# EAGLE design obd (EAGLE 5.11)
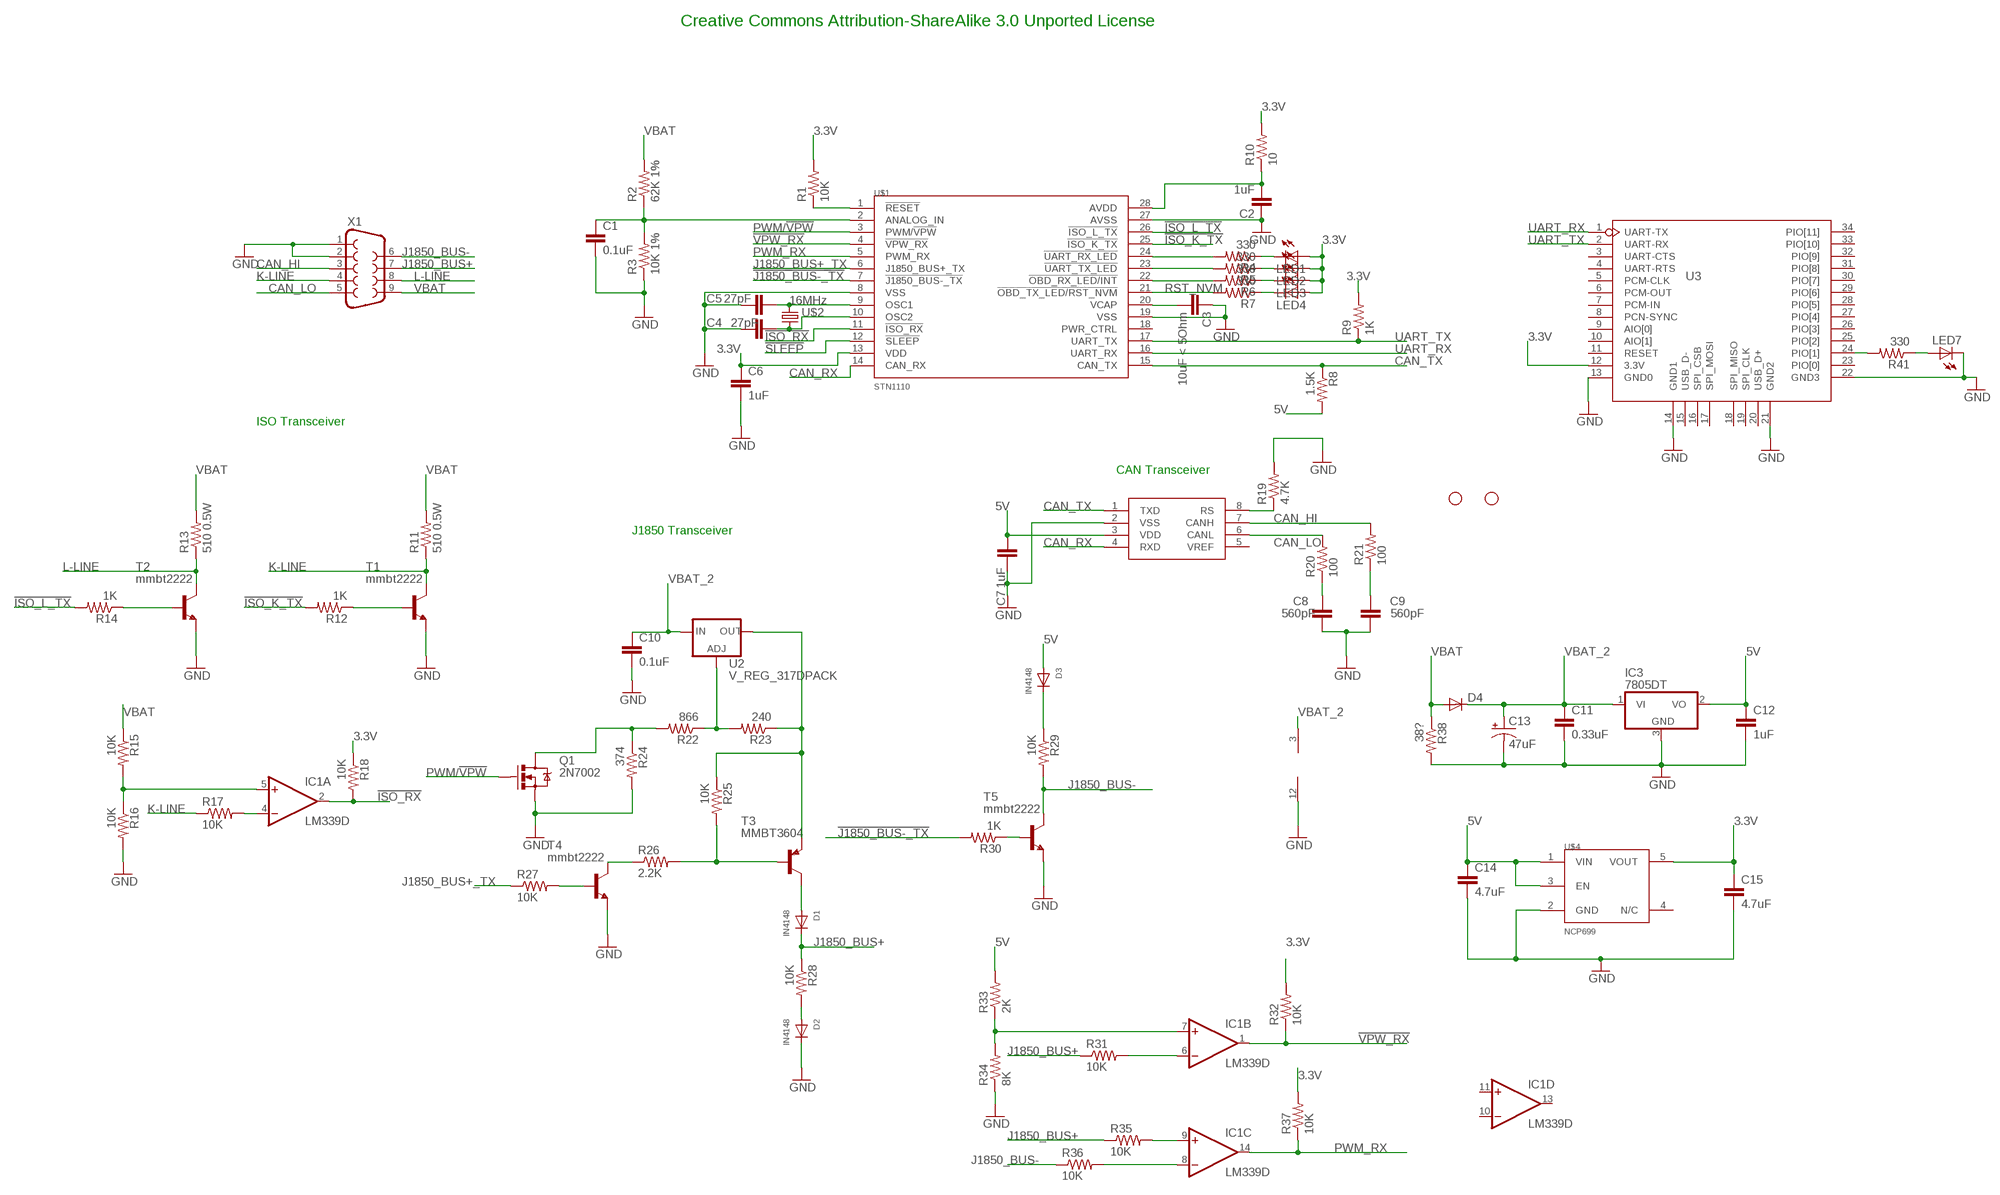
[diagram p0: schematic, sheet 1]

## Parts
C1  0.1uF  CAP0805  [0805]
C2  1uF  CAP0805  [0805]
C3  10uF < 5Ohm  CAP0805  [0805]
C4  27pF  CAP0805  [0805]
C5  27pF  CAP0805  [0805]
C6  1uF  CAP0805  [0805]
C7  1uF  CAP0805  [0805]
C8  560pF  CAP0805  [0805]
C9  560pF  CAP0805  [0805]
C10  0.1uF  CAP0805  [0805]
C11  0.33uF  CAP0805  [0805]
C12  1uF  CAP0805  [0805]
C13  47uF  CAP_POL1206  [EIA3216]
C14  4.7uF  CAP0805  [0805]
C15  4.7uF  CAP0805  [0805]
D1  IN4148  DIODESOD-123  [SOD-123]
D2  IN4148  DIODESOD-123  [SOD-123]
D3  IN4148  DIODESOD-123  [SOD-123]
D4  DIODESOD  [SOD-323]
IC1  LM339D  [SO14]
IC3  7805DT  [TO252]
JP2  STAND-OFF  [STAND-OFF]
JP3  STAND-OFF  [STAND-OFF]
LED1  LEDCHIPLED_0805  [CHIPLED_0805]
LED2  LEDCHIPLED_0805  [CHIPLED_0805]
LED3  LEDCHIPLED_0805  [CHIPLED_0805]
LED4  LEDCHIPLED_0805  [CHIPLED_0805]
LED7  LEDCHIPLED_0805  [CHIPLED_0805]
Q1  2N7002  MOSFET-NCHANNELSMD  [SOT23-3]
R1  10K  RESISTOR0805-RES  [0805]
R2  62K 1%  RESISTOR0805-RES  [0805]
R3  10K 1%  RESISTOR0805-RES  [0805]
R4  330  RESISTOR0805-RES  [0805]
R5  330  RESISTOR0805-RES  [0805]
R6  330  RESISTOR0805-RES  [0805]
R7  330  RESISTOR0805-RES  [0805]
R8  1.5K  RESISTOR0805-RES  [0805]
R9  1K  RESISTOR0805-RES  [0805]
R10  10  RESISTOR0805-RES  [0805]
R11  510 0.5W  RESISTOR1206  [1206]
R12  1K  RESISTOR0805-RES  [0805]
R13  510 0.5W  RESISTOR1206  [1206]
R14  1K  RESISTOR0805-RES  [0805]
R15  10K  RESISTOR0805-RES  [0805]
R16  10K  RESISTOR0805-RES  [0805]
R17  10K  RESISTOR0805-RES  [0805]
R18  10K  RESISTOR0805-RES  [0805]
R19  4.7K  RESISTOR0805-RES  [0805]
R20  100  RESISTOR0805-RES  [0805]
R21  100  RESISTOR0805-RES  [0805]
R22  866  RESISTOR0805-RES  [0805]
R23  240  RESISTOR0805-RES  [0805]
R24  374  RESISTOR0805-RES  [0805]
R25  10K  RESISTOR0805-RES  [0805]
R26  2.2K  RESISTOR0805-RES  [0805]
R27  10K  RESISTOR0805-RES  [0805]
R28  10K  RESISTOR0805-RES  [0805]
R29  10K  RESISTOR0805-RES  [0805]
R30  1K  RESISTOR0805-RES  [0805]
R31  10K  RESISTOR0805-RES  [0805]
R32  10K  RESISTOR0805-RES  [0805]
R33  2K  RESISTOR0805-RES  [0805]
R34  8K  RESISTOR0805-RES  [0805]
R35  10K  RESISTOR0805-RES  [0805]
R36  10K  RESISTOR0805-RES  [0805]
R37  10K  RESISTOR0805-RES  [0805]
R38  38?  RESISTOR0805-RES  [0805]
R41  330  RESISTOR0805-RES  [0805]
T1  mmbt2222  MMBT3904LT1-NPN-SOT23-BEC  [SOT23-BEC]
T2  mmbt2222  MMBT3904LT1-NPN-SOT23-BEC  [SOT23-BEC]
T3  MMBT3604  MMBT3640LT1-PNP-SOT23-BEC  [SOT23-BEC]
T4  mmbt2222  MMBT3904LT1-NPN-SOT23-BEC  [SOT23-BEC]
T5  mmbt2222  MMBT3904LT1-NPN-SOT23-BEC  [SOT23-BEC]
U1  MCP2551  [SO08]
U2  V_REG_317DPACK  [TO252]
U3  BLUETOOTH-SERIAL-SMD  [34P-1.524-27X13-W/-ANT]
U$1  STN1110  [SO-28W]
U$2  16MHz  CRYSTAL-2.5X3.5  [CRYSTAL-2.5X3.5]
U$4  NCP699  [SOT23-5]
X1  DB9MALE  [DB9_M]

## Nets
3.3V: C6.1 C15.1 LED1.A LED2.A LED3.A LED4.A R1.2 R9.2 R10.2 R18.1 R32.2 R37.2 U3.12(3.3V) U$1.13(VDD) U$4.5(VOUT)
5V: C7.2 C12.1 C14.1 D3.A IC3.2(VO) R8.2 R33.2 U1.3(VDD) U$4.1(VIN) U$4.3(EN)
!ISO_K_TX: R12.2 U$1.25(!ISO_K_TX)
!ISO_L_TX: R14.2 U$1.26(!ISO_L_TX)
!ISO_RX: IC1.2(A:OUT) R18.2 U$1.11(!ISO_RX)
!J1850_BUS-_TX: R30.2 U$1.7(!J1850_BUS-_TX)
!SLEEP: U$1.12(!SLEEP)
!VPW_RX: IC1.1(B:OUT) R32.1 U$1.4(!VPW_RX)
CAN_HI: R21.2 U1.7(CANH) X1.3
CAN_LO: R20.2 U1.6(CANL) X1.5
CAN_RX: U1.4(RXD) U$1.14(CAN_RX)
CAN_TX: R8.1 U1.1(TXD) U$1.15(CAN_TX)
GND: C1.2 C2.1 C3.1 C4.1 C5.1 C6.2 C7.1 C8.1 C9.1 C10.2 C11.2 C12.2 C13.C(-) C14.2 C15.2 D2.C IC1.12(P:GND) IC3.3(GND) LED7.C Q1.2(S) R3.1 R16.2 R19.2 R24.2 R34.1 R38.2 T1.E T2.E T4.E T5.E U1.2(VSS) U3.13(GND0) U3.14(GND1) U3.21(GND2) U3.22(GND3) U$1.8(VSS) U$1.19(VSS) U$1.27(AVSS) U$4.2(GND) X1.1 X1.2
J1850_BUS+: D1.C R28.1 R31.1 R35.1 X1.7
J1850_BUS+_TX: R27.1 U$1.6(J1850_BUS+_TX)
J1850_BUS-: R29.2 R36.1 T5.C X1.6
K-LINE: R11.1 R17.1 T1.C X1.4
L-LINE: R13.1 T2.C X1.8
N$1: R4.2 U$1.24(!UART_RX_LED)
N$2: R5.2 U$1.23(!UART_TX_LED)
N$3: R6.2 U$1.22(!OBD_RX_LED/INT)
N$4: R1.1 U$1.1(!RESET)
N$5: LED4.C R7.1
N$6: LED3.C R6.1
N$7: LED2.C R5.1
N$8: LED1.C R4.1
N$9: C1.1 R2.1 R3.2 U$1.2(ANALOG_IN)
N$10: C2.2 R10.1 U$1.28(AVDD)
N$11: C4.2 U$1.10(OSC2) U$2.P$1
N$12: C5.2 U$1.9(OSC1) U$2.P$3
N$13: IC1.4(A:-IN) R17.2
N$14: C3.2 U$1.20(VCAP)
N$15: R22.1 R23.2 U2.1(ADJ)
N$16: R14.1 T2.B
N$17: IC1.5(A:+IN) R15.2 R16.1
N$18: R23.1 R25.1 T3.E U2.4(OUT)
N$19: R12.1 T1.B
N$20: R25.2 R26.2 T3.B
N$21: R26.1 T4.C
N$22: Q1.3(D) R22.2 R24.1
N$23: R27.2 T4.B
N$24: R19.1 U1.8(RS)
N$25: D1.A T3.C
N$26: D3.C R29.1
N$27: C8.2 R20.1
N$28: C9.2 R21.1
N$29: D2.A R28.2
N$30: IC1.9(C:+IN) R35.2
N$31: IC1.8(C:-IN) R36.2
N$33: R30.1 T5.B
N$35: IC1.7(B:+IN) R33.1 R34.2
N$36: IC1.6(B:-IN) R31.2
N$39: R41.2 U3.24(PIO[1])
N$40: LED7.A R41.1
PWM/!VPW: Q1.1(G) U$1.3(PWM/!VPW)
PWM_RX: IC1.14(C:OUT) R37.1 U$1.5(PWM_RX)
RST_NVM: R7.2 U$1.21(!OBD_TX_LED/RST_NVM)
UART_RX: U3.1(UART-TX) U$1.16(UART_RX)
UART_TX: R9.1 U3.2(UART-RX) U$1.17(UART_TX)
VBAT: D4.2(A) R2.2 R11.2 R13.2 R15.1 R38.1 X1.9
VBAT_2: C10.1 C11.1 C13.A(+) D4.1(C) IC1.3(P:V+) IC3.1(VI) U2.3(IN)
Unconnected: IC1.10(D:-IN) IC1.11(D:+IN) IC1.13(D:OUT) U1.5(VREF) U3.3(UART-CTS) U3.4(UART-RTS) U3.5(PCM-CLK) U3.6(PCM-OUT) U3.7(PCM-IN) U3.8(PCN-SYNC) U3.9(AIO[0]) U3.10(AIO[1]) U3.11(RESET) U3.15(USB_D-) U3.16(SPI_CSB) U3.17(SPI_MOSI) U3.18(SPI_MISO) U3.19(SPI_CLK) U3.20(USB_D+) U3.23(PIO[0]) U3.25(PIO[2]) U3.26(PIO[3]) U3.27(PIO[4]) U3.28(PIO[5]) U3.29(PIO[6]) U3.30(PIO[7]) U3.31(PIO[8]) U3.32(PIO[9]) U3.33(PIO[10]) U3.34(PIO[11]) U$1.18(PWR_CTRL) U$4.4(N/C)

## Notes on the sheet
- Creative Commons Attribution-ShareAlike 3.0 Unported License
- ISO Transceiver
- CAN Transceiver
- J1850 Transceiver

## Library data of the parts
C1-C12 C14 C15 = SparkFun:CAP: Capacitor Standard 0603 ceramic capacitor, and 0.1" leaded capacitor.
C13 = SparkFun:CAP_POL: Capacitor Polarized These are standard SMD and PTH capacitors. Normally 10uF, 47uF, and 100uF in electrolytic and tantalum varieties. Always verify the external diameter of the through hole cap, it varies with capacity, voltage, and manufacturer. The EIA devices should be standard.
D1-D3 = adafruit:DIODE: Diode
D4 = SparkFun:DIODE: Diode
IC1 = linear:LM339: Low Power Low Offset Voltage Quad Comparators with open collector; LM139/LM239/LM339/LM2901/LM3302
IC3 = adafruit:78*: Positive VOLTAGE REGULATOR Added bigger pads to the TO-92 package
JP2 JP3 = SparkFun:STAND-OFF: Stand Off This is the mechanical footprint for a #4 phillips button head screw. Use the keepout ring to avoid running the screw head into surrounding components. SKU : PRT-00447
LED1-LED4 LED7 = adafruit:LED: LED OSRAM: - CHIPLED LG R971, LG N971, LY N971, LG Q971, LY Q971, LO R971, LY R971 LH N974, LH R974 LS Q976, LO Q976, LY Q976 LO Q996 - Hyper CHIPLED LW Q18S LB Q993, LB Q99A, LB R99A - SideLED LS A670, LO A670, LY A670, LG A670, LP A670 LB A673, LV A673, LT A673, LW A673 LH A674 LY A675 LS A676, LA A676, LO A676, LY A676, LW A676 LS A679, LY A679, LG A679 - Hyper Micro SIDELED® LS Y876, LA Y876, LO Y876, LY Y876 LT Y87S - SmartLED LW L88C, LW L88S LB L89C, LB L89S, LG L890 LS L89K, LO L89K, LY L89K LS L896, LA L896, LO L896, LY L896 - TOPLED LS T670, LO T670, LY T670, LG T670, LP T670 LSG T670, LSP T670, LSY T670, LOP T670, LYG T670 LG T671, LOG T671, LSG T671 LB T673, LV T673, LT T673, LW T673 LH T674 LS T676, LA T676, LO T676, LY T676, LB T676, LH T676, LSB T676, LW T676 LB T67C, LV T67C, LT T67C, LS T67K, LO T67K, LY T67K, LW E67C LS E67B, LA E67B, LO E67B, LY E67B, LB E67C, LV E67C, LT E67C LW T67C LS T679, LY T679, LG T679 LS T770, LO T770, LY T770, LG T770, LP T770 LB T773, LV T773, LT T773, LW T773 LH T774 LS E675, LA E675, LY E675, LS T675 LS T776, LA T776, LO T776, LY T776, LB T776 LHGB T686 LT T68C, LB T68C - Hyper Mini TOPLED® LB M676 - Mini TOPLED Santana® LG M470 LS M47K, LO M47K, LY M47K Source: http://www.osram.convergy.de/
Q1 = SparkFun:MOSFET-NCHANNEL
R1-R38 R41 = SparkFun:RESISTOR: Resistor Basic schematic elements and footprints for 0603, 1206, and PTH resistors.
T1 T2 T4 T5 = transistor:*-NPN-: NPN Transistror BF959 corrected 2008.03.06
T3 = transistor-neu-to92:*-PNP-: PNP Transistror
U1 = SparkFun:MCP2551
U2 = FitnessDevice:V_REG_317: Voltage Regulator Standard LM317 adjustable voltage regulator. AOI (Adjust Output Input). Google 'LM317 Calculator' for easy to use app to get the two resistor values needed. 240/720 for 5V output. 240/390 for 3.3V output. Spark Fun Electronics SKU : COM-00527
U3 = Module:BLUETOOTH-SERIAL
U$1 = FitnessDevice:STN1110: Multiprotocol OBD to UART Interpreter
U$2 = FitnessDevice:CRYSTAL-2.5X3.5: ABRACON - ABM8G-16.000MHZ-B4Y-T - Crystal Newark Part Number: 60R3957
U$4 = FitnessDevice:NCP699: 150 mA CMOS Low Iq LDO with Enable in TSOP-5
X1 = FitnessDevice:DB9: DB9 Connector Standard DB9 (D-Sub 9) serial connector. Can be used for CAN bus as well as RS485 and RS232. Footprint production proven. Spark Fun Electronics SKU : PRT-00429

## Board
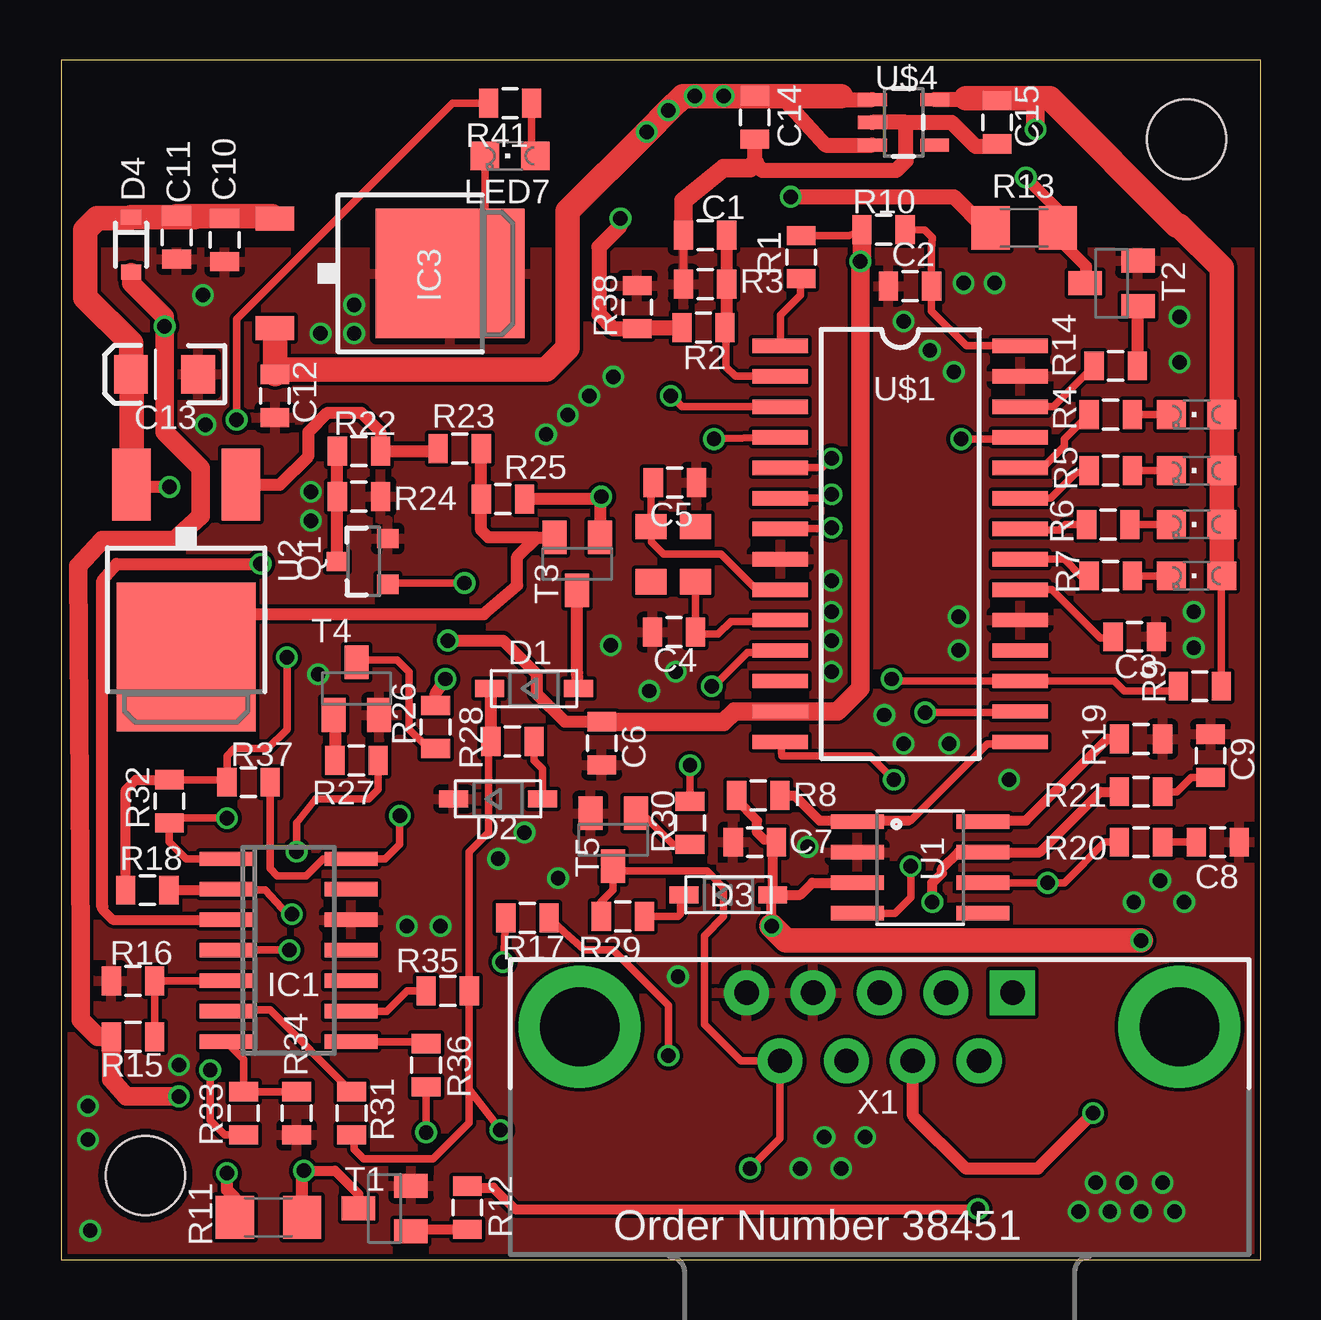
[diagram p1: board, top side]
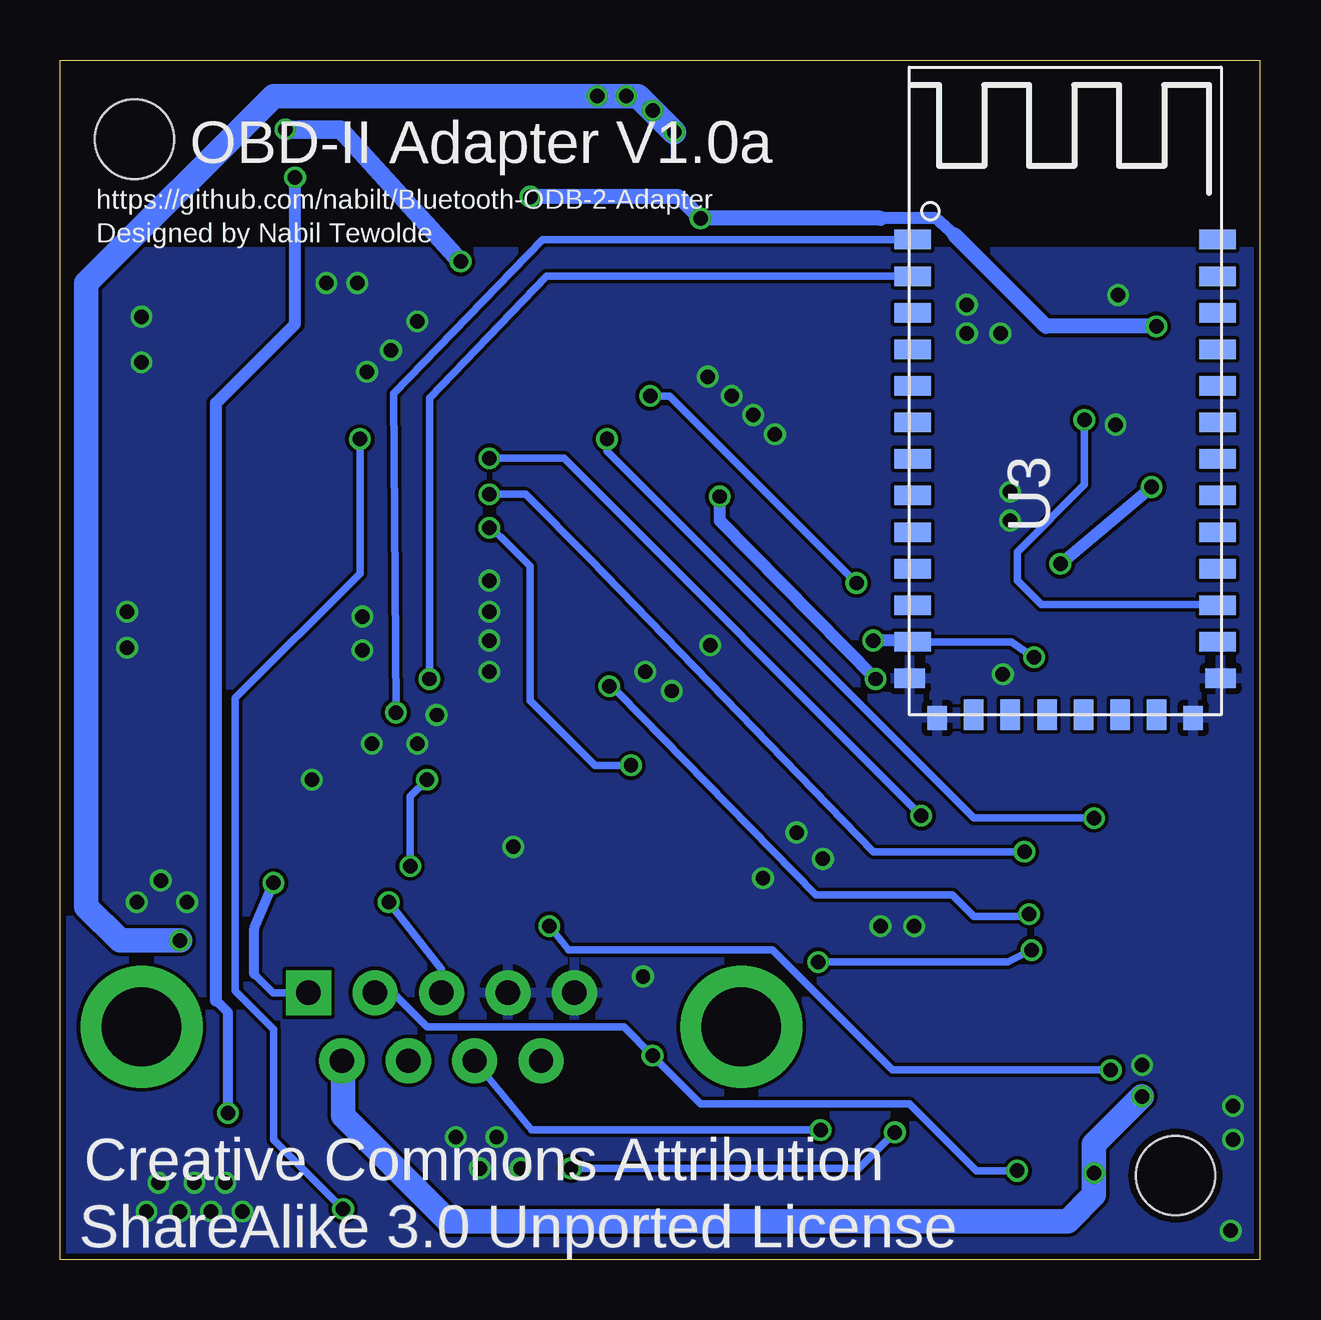
[diagram p2: board, bottom side, seen from below]

Size 50 x 50 mm. Coordinates in mm from the lower left corner, seen from the top.
Outline: 0,0 50,0 50,50 0,50 0,0
Copper layers (1*16): Top 0.035mm / dielectric 1.5mm / Bottom 0.035mm
Design rules "ITead_rule": minimum track width 6mil, minimum drill 12mil, track to track 6mil, track to pad 6mil, pad to pad 6mil, via to via 6mil, smd to smd 0mil, copper to edge 10mil, drill to drill 10mil, minimum pad ring 10mil, minimum via ring 6mil, stop-mask expansion 2mil, vias tented up to drill 100mil, thermal gap 10mil

### Footprints (pad centres in the part's own frame; a part is rotated, then mirrored left to right if it is on the bottom)
0805 = smd 0.8 x 1.2: 1 -0.9,0; 2 0.9,0
EIA3216 = smd 1.4 x 1.6: A 1.4,0; C -1.4,0
SOD-123 = smd 1.2 x 0.7: A 1.85,0; C -1.85,0
SOD-323 = smd 0.63 x 0.83: 1 -1.15,0; 2 1.15,0
SO14 = smd 0.6 x 2.2: 1 -3.81,-2.6; 2 -2.54,-2.6; 3 -1.27,-2.6; 4 0,-2.6; 5 1.27,-2.6; 6 2.54,-2.6; 7 3.81,-2.6; 8 3.81,2.6; 9 2.54,2.6; 10 1.27,2.6; 11 0,2.6; 12 -1.27,2.6; 13 -2.54,2.6; 14 -3.81,2.6
TO252 = smd 1 x 1.6: 1 -2.28,-4.8; 2 2.28,-4.8 | smd 5.4 x 6.2: 3 0,2.5
STAND-OFF = hole 3.302: 0,0
CHIPLED_0805 = smd 1.2 x 1.2: A 0,-1.05; C 0,1.05
SOT23-3 = smd 0.8 x 0.9: 1 -0.95,-1; 2 0.95,-1; 3 0,1.1
1206 = smd 1.6 x 1.8: 1 -1.4,0; 2 1.4,0
SOT23-BEC = smd 1 x 1.4: B -0.95,-1.1; C 0,1.1; E 0.95,-1.1
SO08 = smd 0.61 x 2.21: 1 -1.905,-2.616; 2 -0.635,-2.616; 3 0.635,-2.616; 4 1.905,-2.616; 5 1.905,2.616; 6 0.635,2.616; 7 -0.635,2.616; 8 -1.905,2.616
TO252' = smd 1.6 x 3: 1 -2.28,-4.8; 3 2.28,-4.8 | smd 5.8 x 6.2: 4 0,2.38
34P-1.524-27X13-W/-ANT = smd 1.524 x 0.813: 1 -6.35,19.812; 2 -6.35,18.288; 3 -6.35,16.764; 4 -6.35,15.24; 5 -6.35,13.716; 6 -6.35,12.192; 7 -6.35,10.668; 8 -6.35,9.144; 9 -6.35,7.62; 10 -6.35,6.096; 11 -6.35,4.572; 12 -6.35,3.048; 23 6.35,3.048; 24 6.35,4.572; 25 6.35,6.096; 26 6.35,7.62; 27 6.35,9.144; 28 6.35,10.668; 29 6.35,12.192; 30 6.35,13.716; 31 6.35,15.24; 32 6.35,16.764; 33 6.35,18.288; 34 6.35,19.812 | smd 1.27 x 0.813: 13 -6.477,1.524; 22 6.477,1.524 | smd 0.813 x 1.016: 14 -5.334,-0.127; 21 5.334,-0.127 | smd 0.813 x 1.27: 15 -3.81,0; 16 -2.286,0; 17 -0.762,0; 18 0.762,0; 19 2.286,0; 20 3.81,0
SO-28W = smd 0.6 x 2.3: 1 -8.255,-5; 2 -6.985,-5; 3 -5.715,-5; 4 -4.445,-5; 5 -3.175,-5; 6 -1.905,-5; 7 -0.635,-5; 8 0.635,-5; 9 1.905,-5; 10 3.175,-5; 11 4.445,-5; 12 5.715,-5; 13 6.985,-5; 14 8.255,-5; 15 8.255,5; 16 6.985,5; 17 5.715,5; 18 4.445,5; 19 3.175,5; 20 1.905,5; 21 0.635,5; 22 -0.635,5; 23 -1.905,5; 24 -3.175,5; 25 -4.445,5; 26 -5.715,5; 27 -6.985,5; 28 -8.255,5
CRYSTAL-2.5X3.5 = smd 1.05 x 1.3: P$1 -1.15,-0.925; P$2 1.15,-0.925; P$3 1.15,0.925; P$4 -1.15,0.925
SOT23-5 = smd 0.55 x 1.2: 1 -0.95,-1.3; 2 0,-1.3; 3 0.95,-1.3; 4 0.95,1.3; 5 -0.95,1.3
DB9_M = drill 1.016 pad 1.88 round: 1 5.54,-1.42; 2 2.77,-1.42; 3 0,-1.42; 4 -2.77,-1.42; 6 4.15,1.42; 7 1.38,1.42; 8 -1.38,1.42; 9 -4.15,1.42 | drill 1.016 pad 1.88 square: 5 -5.54,-1.42 | drill 3.302 pad 5.08 round: G1 -12.5,0; G2 12.5,0

### Placement (x,y rotation side)
C1  26.83,42.7 180 top
C2  35.37,40.57 0 top
C3  44.73,25.96 180 top
C4  25.53,26.16 0 top
C5  25.57,32.39 180 top
C6  22.52,21.52 270 top
C7  28.9,17.4 0 top
C8  48.2,17.4 180 top
C9  47.9,21 270 top
C10  6.8,42.5 270 top
C11  4.8,42.6 270 top
C12  8.9,36 270 top
C13  4.3,36.9 180 top
C14  28.9,47.6 270 top
C15  39,47.4 270 top
D1  19.7,23.8 0 top
D2  18.2,19.2 0 top
D3  27.8,15.2 0 top
D4  2.9,42.3 270 top
IC1  9.47,12.89 270 top
IC3  13.7,41.1 270 top
JP2  46.9,46.7 0 top
JP3  3.5,3.5 0 top
LED1  47.31,35.22 90 top
LED2  47.31,32.88 90 top
LED3  47.31,30.64 90 top
LED4  47.31,28.5 90 top
LED7  18.7,46 90 top
Q1  12.6,29.1 90 top
R1  30.83,41.78 90 top
R2  26.76,38.84 180 top
R3  26.83,40.66 0 top
R4  43.73,35.22 180 top
R5  43.73,32.88 180 top
R6  43.63,30.64 180 top
R7  43.73,28.5 180 top
R8  29.05,19.34 180 top
R9  47.45,23.9 0 top
R10  34.27,42.93 180 top
R11  8.63,1.76 180 top
R12  16.92,2.16 90 top
R13  40.13,43 180 top
R14  43.94,37.25 180 top
R15  2.98,9.28 0 top
R16  2.98,11.62 180 top
R17  19.42,14.24 180 top
R18  3.58,15.4 0 top
R19  45,21.7 0 top
R20  45,17.4 180 top
R21  45,19.5 180 top
R22  12.4,33.7 180 top
R23  16.6,33.8 180 top
R24  12.4,31.8 0 top
R25  18.4,31.7 0 top
R26  15.6,22.2 90 top
R27  12.3,20.8 180 top
R28  18.8,21.6 0 top
R29  23.4,14.3 180 top
R30  26.2,18.2 90 top
R31  12.1,6.1 90 top
R32  4.5,19.1 90 top
R33  7.6,6.1 270 top
R34  9.8,6.1 90 top
R35  16.1,11.2 180 top
R36  15.2,8.1 90 top
R37  7.8,19.9 180 top
R38  24,39.7 90 top
R41  18.7,48.2 180 top
T1  13.47,2.13 90 top
T2  43.77,40.69 90 top
T3  21.5,29 180 top
T4  12.3,23.8 0 top
T5  23,17.5 180 top
U1  35.79,16.34 270 top
U2  V_REG_317DPACK  [TO252']  5.2,27.5 180 top
U3  8.1,22.7 0 bottom
U$1  34.96,29.83 270 top
U$2  25.5,29.4 90 top
U$4  35.1,47.4 270 top
X1  34.1,9.7 180 top

### Tracks (layer width: path | path; a pad name or v marks a point on that pad's centre or on a via)
3.3V  (via drill 0.6)
  Top 0.305: R9.2 48.35,28.99 LED4.A | R32.2 6.9,20 R37.2 6.9,21 7.2,21.3 8.6,21.3 9.4,22.1 v9.4,25.1 | R1.2 32.82,42.68 R10.2
  Top 0.406: R32.2 3.1,20 2.68,19.58 R18.1
  Top 0.508: C6.1 20.98,22.42 19.8,23.6 19.8,24.4 18.4,25.8 v16.1,25.8
  Top 0.635: U$4.5 37.65,48.35 37.7,48.4
  Top 0.762: C6.1 22.54,22.4 27.6,22.4 28.05,22.84 U$1.13 32.34,22.84 33.3,23.8 v33.3,41.6 33.37,41.57 R10.2 | 37.7,48.4 37.8,48.3 C15.1 | v40.6,47.1 40.6,48.4
  Top 1.016: 37.7,48.4 40.6,48.4 41.2,48.4 46.5,43.1 46.6,43.1 48.36,41.34 LED1.A LED2.A LED3.A LED4.A
  Bottom 0.305: U3.12 10.35,25.75 v9.4,25.1
  Bottom 0.508: v16.1,25.8 14.5,25.8 U3.12
  Bottom 0.762: v33.3,41.6 38.3,47.1 v40.6,47.1
5V  (via drill 0.6)
  Top 0.305: v6.2,7.9 6.2,5.8 6.8,5.2 R33.2 | D3.A 29.7,15.2 29.7,15.25 D3.A
  Top 0.406: v29.6,13.9 29.6,15.15 D3.A 29.65,17.25 C7.2 29.7,17.5 29.3,17.5 29,17.8 29,18.3 28.15,19.15 R8.2 | 29.7,15.2 30.8,15.2 31.3,15.7 U1.3
  Top 0.635: U$4.1 32.55,48.35 32.4,48.5 | U$4.3 31.85,46.45 30,48.5
  Top 1.016: C12.1 IC3.2 8.9,37.2 9,37.1 20.2,37.1 21.1,38 21.1,43.7 v24.4,47 v25.3,47.9 25.9,48.5 v26.4,48.5 C14.1 30,48.5 32.4,48.5 32.5,48.5 | v45,13.3 30.2,13.3 v29.6,13.9
  Bottom 0.305: v29.6,13.9 28.8,12.9 20.3,12.9 15.3,7.9 v6.2,7.9
  Bottom 1.016: v45,13.3 47.5,13.3 48.9,14.7 48.9,40.7 41.1,48.5 v27.6,48.5 25.9,48.5 v24.4,47
!ISO_K_TX  (via drill 0.6)
  Top 0.305: v37.5,34.2 39.88,34.2 U$1.25
  Top 0.406: v38.2,2.1 18.9,2.1 18,3 16.98,3 R12.2
  Bottom 0.305: v38.2,2.1 41.1,5 41.1,9.6 42.7,11.2 42.7,23.4 37.5,28.6 v37.5,34.2
!ISO_L_TX
  Top 0.305: U$1.26 41.34,35.55 R14.2
!ISO_RX  (via drill 0.6)
  Top 0.305: 7,15.3 IC1.2 6.9,15.4 8.5,15.4 9.4,14.4 v9.6,14.4 | v27.1,23.9 27.2,23.9 28.6,25.3 29.88,25.3 U$1.11
  Top 0.406: R18.2 6.84,15.4 IC1.2
  Bottom 0.305: v9.6,14.4 9.7,14.3 11.9,14.3 12.8,15.2 18.5,15.2 26.7,23.6 27,23.9 v27.1,23.9
!J1850_BUS-_TX  (via drill 0.6)
  Top 0.305: R30.2 v26.2,20.6 | 30.05,30.6 U$1.7 32.06,30.46 v32.1,30.5
  Bottom 0.305: v26.2,20.6 27.7,20.6 30.4,23.3 30.4,28.9 31.6,30.1 v32.1,30.5
!VPW_RX  (via drill 0.6)
  Top 0.305: v6.9,18.4 4.7,18.4 R32.1 4.5,17.4 5.2,16.7 IC1.1 | v27.2,34.2 27.62,34.23 U$1.4
  Bottom 0.305: v6.9,18.4 11.9,18.4 27.2,33.7 v27.2,34.2
CAN_HI  (via drill 0.6)
  Top 0.305: v36.3,14.9 36.2,14.7
  Top 0.406: R21.2 43.3,19.5 40.77,16.98 U1.7 38.38,17 37.4,17 36.7,16.3 36.7,16.1 36.3,15.7 v36.3,14.9
  Bottom 0.305: X1.3 34.1,12.1 v36.3,14.9
CAN_LO  (via drill 0.6)
  Top 0.305: U1.6 v41.1,15.71 41.8,15.71 43.5,17.4 R20.2
  Top 0.406: v41.1,15.7 v41.1,15.71
  Bottom 0.305: 41.9,11.9 41.12,11.12 X1.5
  Bottom 0.406: 41.9,11.9 41.9,13.8 v41.1,15.7
CAN_RX  (via drill 0.6)
  Top 0.305: U1.4 34.73,14.44 35.4,15.1 v35.4,16.4 | v34.7,20 33.7,21 30.04,21 U$1.14
  Bottom 0.305: v35.4,16.4 35.4,19.3 v34.7,20
CAN_TX
  Top 0.305: U1.1 33.17,18.32 | 35.3,18.3 35.4,18.3 38.6,21.5 39.88,21.5 U$1.15
  Top 0.406: U1.1 33.12,18.3 31.6,18.3 30.56,19.34 R8.1 | 33.17,18.32 33.19,18.3 35.3,18.3
GND  (via drill 0.6)
  Top 0.305: C1.2 R3.1 | LED7.C 17.65,41.75 16.3,40.4
  Top 0.406: 16.3,40.2 16.3,40.4 16.3,41 IC3.3
  Top 0.635: 35.2,47.4 37.1,47.4 38.1,46.4 38.9,46.4 C15.2 | 35.2,47.4 U$4.2 | 35.2,47.4 35.2,45.8 34.8,45.4 29.2,45.4 28.9,45.7 C14.2
  Top 0.762: C1.2 25.93,44.13 27.6,45.5 28.7,45.5 28.9,45.7
  other vias: 45.8,15.8 25.6,24.5 22.9,25.6 15.8,13.9 20.7,15.9 1.1,6.4 4.9,8.1 1.1,5 30.8,3.8 32.5,3.8 31.8,5.1 33.5,5.1 42.4,2 43.7,2 45,2 46.4,2 43.1,3.2 44.4,3.2 45.9,3.2 44.7,14.9 46.8,14.9 47.2,25.5 47.2,27 21.1,35.2 20.2,34.4 22,36 25.7,11.8 34.3,22.7 6,34.8 10.4,30.8 10.4,32 14.4,13.9 32.1,24.5 32.1,25.8 32.1,27 32.1,28.3 31.1,17.2 37.4,25.4 37.4,26.8 12.2,38.6 24.5,23.7 37.2,37 10.8,38.6 12.2,39.8 23,36.8 39.5,20 18.2,16.7 19.3,17.8 46.6,37.4 46.6,39.3 37.6,40.7 38.9,40.7 1.2,1.2 35.1,39.1 36.2,37.9 10.7,24.4 37,21.5 35.1,21.5 5.9,40.2
  pour Top (rank 4): 0,0 0,42 50,42 50,0
  pour Bottom (rank 2): 0,-0.1 0,42 50,42 50,0
J1850_BUS+  (via drill 0.6)
  Top 0.305: R28.1 17.8,21.5 17.8,17.8 17,17 R35.1 17,7.1 | 17,7.1 v18.3,5.4 | 17,7.1 17,5.7 15.5,4.2 12.6,4.2 12.2,4.6 12.2,5.1 R31.1
  Top 0.508: R28.1 17.9,23.75 D1.C
  Bottom 0.305: v18.3,5.4 30.34,5.4 X1.7
J1850_BUS+_TX  (via drill 0.6)
  Top 0.305: R27.1 13.2,19.6 12.8,19.2 10.6,19.2 9.8,18.2 v9.8,17 | U$1.6 31.93,31.73 v32.1,31.9
  Bottom 0.305: v9.8,17 16.1,17 27.9,29.2 30.6,31.9 v32.1,31.9
J1850_BUS-  (via drill 0.6)
  Top 0.305: R29.2 22.5,14.9 23,15.4 T5.C 23.2,16.2 26.9,16.2 27.6,15.5 27.6,14.3 26.8,13.5 26.8,9.8 28.32,8.28 X1.6 29.95,5.05 v28.7,3.8 | R36.1 v15.2,5.3
  Bottom 0.305: v15.2,5.3 16.7,3.8 v28.7,3.8
K-LINE  (via drill 0.6)
  Top 0.305: R17.1 20.96,13.64 21.8,12.9 23,12.9 25.3,10.6 v25.3,8.5
  Top 0.406: T1.C 12.37,2.73 11.4,3.7 v10.1,3.7
  Top 0.508: R11.1 10.03,3.63 v10.1,3.7
  Bottom 0.305: v10.1,3.7 11.8,3.7 14.6,6.5 23.3,6.5 v25.3,8.5 26.5,9.7 34.7,9.7 36.12,11.12 X1.4
L-LINE  (via drill 0.6)
  Top 0.508: v43,6.1 40.7,3.8 37.7,3.8 35.5,6 35.5,8.26 X1.8 | v40.2,45.1 41.53,43.77 R13.1 41.53,42.57 42.7,41.4 42.7,40.72 T2.C
  Bottom 0.406: 43.5,10.8 43,10.3 v43,6.1
  Bottom 0.508: 43.5,10.8 43.5,35.7 40.2,39 v40.2,45.1
N$1
  Top 0.305: U$1.24 40.91,33.01 41.8,33.9 41.8,34.19 R4.2
N$2
  Top 0.305: U$1.23 41.23,31.73 42.3,32.8 42.75,32.8 R5.2
N$3
  Top 0.305: R6.2 41.84,30.64 41.6,30.4 40.02,30.4 U$1.22
N$4
  Top 0.305: 30.9,40.85 R1.1 30.8,40.81 30.8,40.2 29.96,39.36 U$1.1
N$5
  Top 0.305: R7.1 LED4.C
N$6
  Top 0.305: R6.1 LED3.C
N$7
  Top 0.305: R5.1 LED2.C
N$8
  Top 0.305: R4.1 LED1.C
N$9
  Top 0.305: 27.73,38.77 27.7,38.74 | U$1.2 28.09,36.81 27.7,37.2 27.7,38.8 R2.1
  Top 0.508: C1.1 R3.2 27.73,38.77 R2.1
N$10
  Top 0.305: C2.2 36.3,40.74 | C2.2 36.27,42.13 36.3,42.6 36,42.9 R10.1 | C2.2 36.27,39.53 37.72,38.09 U$1.28
N$11
  Top 0.305: U$1.10 29.91,26.6 27.9,26.6 27.36,26.07 26.52,26.07 C4.2 U$2.P$1
N$12
  Top 0.305: U$1.9 28.98,27.93 27.5,29.4 25.1,29.4 24.6,29.9 24.6,30.52 U$2.P$3 24.57,32.3 C5.2
N$13  (via drill 0.6)
  Top 0.305: R17.2 18.42,12.38 v18.4,12.4 | v9.5,12.9 IC1.4
  Bottom 0.305: v18.4,12.4 10.5,12.4 v9.5,12.9
N$14
  Top 0.305: U$1.20 41.27,27.93 43.3,25.9 43.77,25.9 C3.2
N$15
  Top 0.508: U2.1 9.1,32.3 10.3,33.5 10.3,34.5 11.1,35.3 12.5,35.3 13.3,34.5 R22.1 15.6,33.7 R23.2
N$16
  Top 0.508: T2.B 44.87,37.28 R14.1
N$17
  Top 0.305: R15.2 R16.1 6.18,11.62 6.2,11.6 6.85,11.6 IC1.5
N$18
  Top 0.508: 19.8,30.1 19,29.3 19,28.1 17.6,26.9 6.4,26.9 6,26.3 6,25.92 U2.4 | 19.8,30.1 T3.E | R23.1 R25.1 17.5,30.4 17.8,30.1 19.8,30.1
N$19
  Top 0.406: R12.1 14.65,1.26 T1.B
N$20  (via drill 0.6)
  Top 0.508: T3.B 22.45,31.75 v22.5,31.8 22.4,31.7 R25.2 | v16,24.2 15.6,23.6 R26.2
  Bottom 0.508: v22.5,31.8 22.5,30.8 v16,24.2
N$21
  Top 0.305: R26.1 15.3,21.3 14.5,22.1 14.5,24.5 14,25 12.4,25 T4.C
N$22
  Top 0.508: R22.2 R24.1 Q1.3
N$23
  Top 0.508: R27.2 11.4,22.65 T4.B
N$24
  Top 0.305: R19.1 44,21.6
  Top 0.406: U1.8 38.46,18.3 40.2,18.3 43.6,21.7 R19.1
N$25
  Top 0.508: T3.C 21.5,24.45 D1.A
N$26
  Top 0.305: R29.1 25.7,14.3 25.8,14.4 25.8,15.05 D3.C
N$27
  Top 0.305: R20.1 C8.2
N$28
  Top 0.305: R21.1 46.5,19.5 47.1,20.1 C9.2
N$29
  Top 0.305: D2.A 20.05,20.45 19.7,20.8 R28.2
N$30
  Top 0.305: IC1.9 13.55,10.35 14.4,11.2 R35.2
N$31
  Top 0.305: IC1.8 15.12,9.08 R36.2
N$33
  Top 0.305: T5.B 24.2,18.6 25.5,17.3 R30.1
N$35
  Top 0.305: IC1.7 7.6,8.35 R33.1 R34.2
N$36
  Top 0.305: R31.2 8.7,10.4 6.92,10.4 IC1.6
N$39  (via drill 0.6)
  Top 0.305: v7.3,35 7.3,39.2 16.3,48.2 R41.2
  Top 0.406: R41.2 17.7,48.1
  Bottom 0.305: v7.3,35 7.3,32.3 10.1,29.5 10.1,28.3 9.1,27.3 1.78,27.3 U3.24
N$40
  Top 0.305: 19.6,46.15 R41.1
  Top 0.406: LED7.A 19.6,46.15
PWM/!VPW  (via drill 0.6)
  Top 0.305: v16.8,28.2 13.65,28.2 Q1.1 | U$1.3 25.86,35.55 v25.4,36
  Bottom 0.305: v16.8,28.2 24.6,36 v25.4,36
PWM_RX  (via drill 0.6)
  Top 0.305: v14.1,18.5 14.1,17.3 13.5,16.7 IC1.14 10.9,16.7 10.2,16 9,16 8.7,16.3 R37.1 8.7,20.3 | U$1.5 31.7,33.01 v32.1,33.4
  Bottom 0.305: v14.1,18.5 29,33.4 v32.1,33.4
RST_NVM
  Top 0.305: R7.2 42.5,28.5 41.8,29.2 U$1.21
UART_RX  (via drill 0.6)
  Top 0.305: v36,22.8 39.8,22.8 39.87,22.8 U$1.16
  Bottom 0.305: U3.1 29.89,42.51 36.1,36.1 36,22.9 v36,22.8
UART_TX  (via drill 0.6)
  Top 0.305: 46.31,23.66 R9.1 46.35,23.7 44.3,23.7 43.88,24.11 U$1.17 34.69,24.11 v34.6,24.2
  Bottom 0.305: U3.2 29.71,40.99 34.6,35.9 v34.6,24.2
VBAT  (via drill 0.6)
  Top 0.305: R38.1 24.04,38.84
  Top 0.406: D4.2 2.95,41.1
  Top 0.508: R11.2 7.23,2.57 6.9,2.9 v6.9,3.6
  Top 0.635: v23.3,43.4 23.3,43.1 22.4,42.2 22.4,39.4 23,38.8 R38.1 | 24.04,38.84 R2.2 | R13.2 38.5,43 37.2,44.3 v30.4,44.3
  Top 0.762: v4.9,6.8 2.7,6.8 2.08,7.52 R15.1 1.52,9.28 0.8,10 0.8,13.2 0.7,28.9 1.7,30 4.7,30 5.8,31 5.8,33 4.3,34.5 v4.3,38.9 4.3,39.3 2.9,40.7 D4.2
  Bottom 0.508: 12.7,42.7 13.5,43.4 15.8,43.4
  Bottom 0.635: v4.3,38.9 8.9,38.9 12.7,42.7 | 15.8,43.4 v23.3,43.4 24.2,44.3 v30.4,44.3
  Bottom 1.016: v4.9,6.8 6.9,4.8 v6.9,3.6 6.9,2.7 8,1.6 33.8,1.6 38.2,6 38.2,8.23 X1.9
VBAT_2  (via drill 0.6)
  Top 0.406: C10.1 6.3,43.4 6.2,43.5 | IC1.3 2.14,14.16 1.7,14.6 1.7,14.7 | 2.82,32.2 U2.3
  Top 0.508: v4.5,32.2 2.82,32.2 | 1.7,14.7 1.7,28.3 2.3,29 v8.3,29
  Top 1.016: U2.3 2.92,36.88 C13.A 2.9,38.2 1,40.1 1,42.9 1.5,43.4 2.85,43.4 D4.1 5.55,43.45 C11.1 6.2,43.5 8.78,43.5 IC3.1
  Bottom 0.508: v8.3,29 v4.5,32.2

### Text on the board
tNames: Order Number 38451
bNames: OBD-II Adapter V1.0a | https://github.com/nabilt/Bluetooth-ODB-2-Adapter | Designed by Nabil Tewolde | Creative Commons Attribution | ShareAlike 3.0 Unported License